# Altium schematic sheet Key_Reset.SchDoc
size 53 x 33 mm
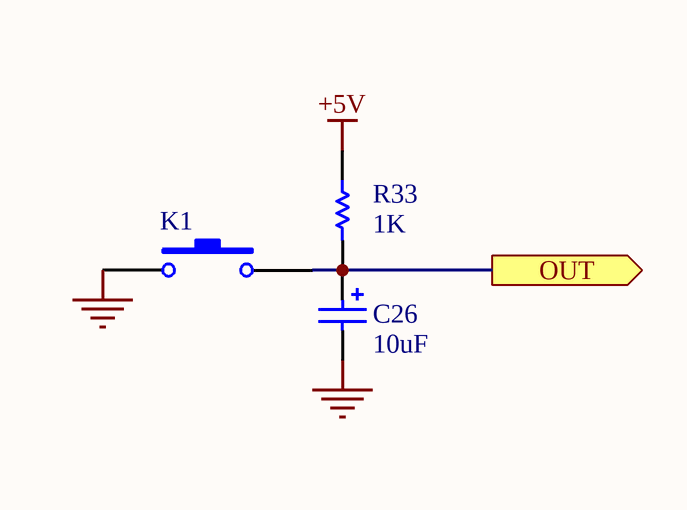
[diagram p0: Key_Reset.SchDoc]

## Parts
C26  value 10uF  [CAPPR2.5-6.3x5]  (hidden comment: Cap Pol1)
K1  SW-PB  [SPST-2_2]  (value not drawn)
R33  value 1K  [AXIAL-0.4]  (hidden comment: Res1)

## Ports
OUT (out)

## Nets
+5V: R33.1
GND: C26.2 K1.1
OUT: C26.1 K1.2 R33.2 ; port OUT

## Library data of the parts
C26 = Cap Pol1: Polarized Capacitor (Radial); Manufacturer: Generic Components; Class I: Passive; Published: 8-Jun-2000; Revision: July-2002: Re-released for DXP Platform.; Publisher: Altium Limited; Class II: Capacitor
K1 = SW-PB: Switch; Manufacturer: Generic Components; Published: 24-Mar-1999; Revision: July-2002: Re-released for DXP Platform.; Publisher: Altium Limited
R33 = Res1: Resistor; Manufacturer: Generic Components; Class I: Passive; Published: 8-Jun-2000; Revision: July-2002: Re-released for DXP Platform.; Publisher: Altium Limited; Class II: Resistor